# EAGLE schematic stm32f072 (EAGLE 7.7.0)

## Sheet 1 of 3: Keyboard Controller
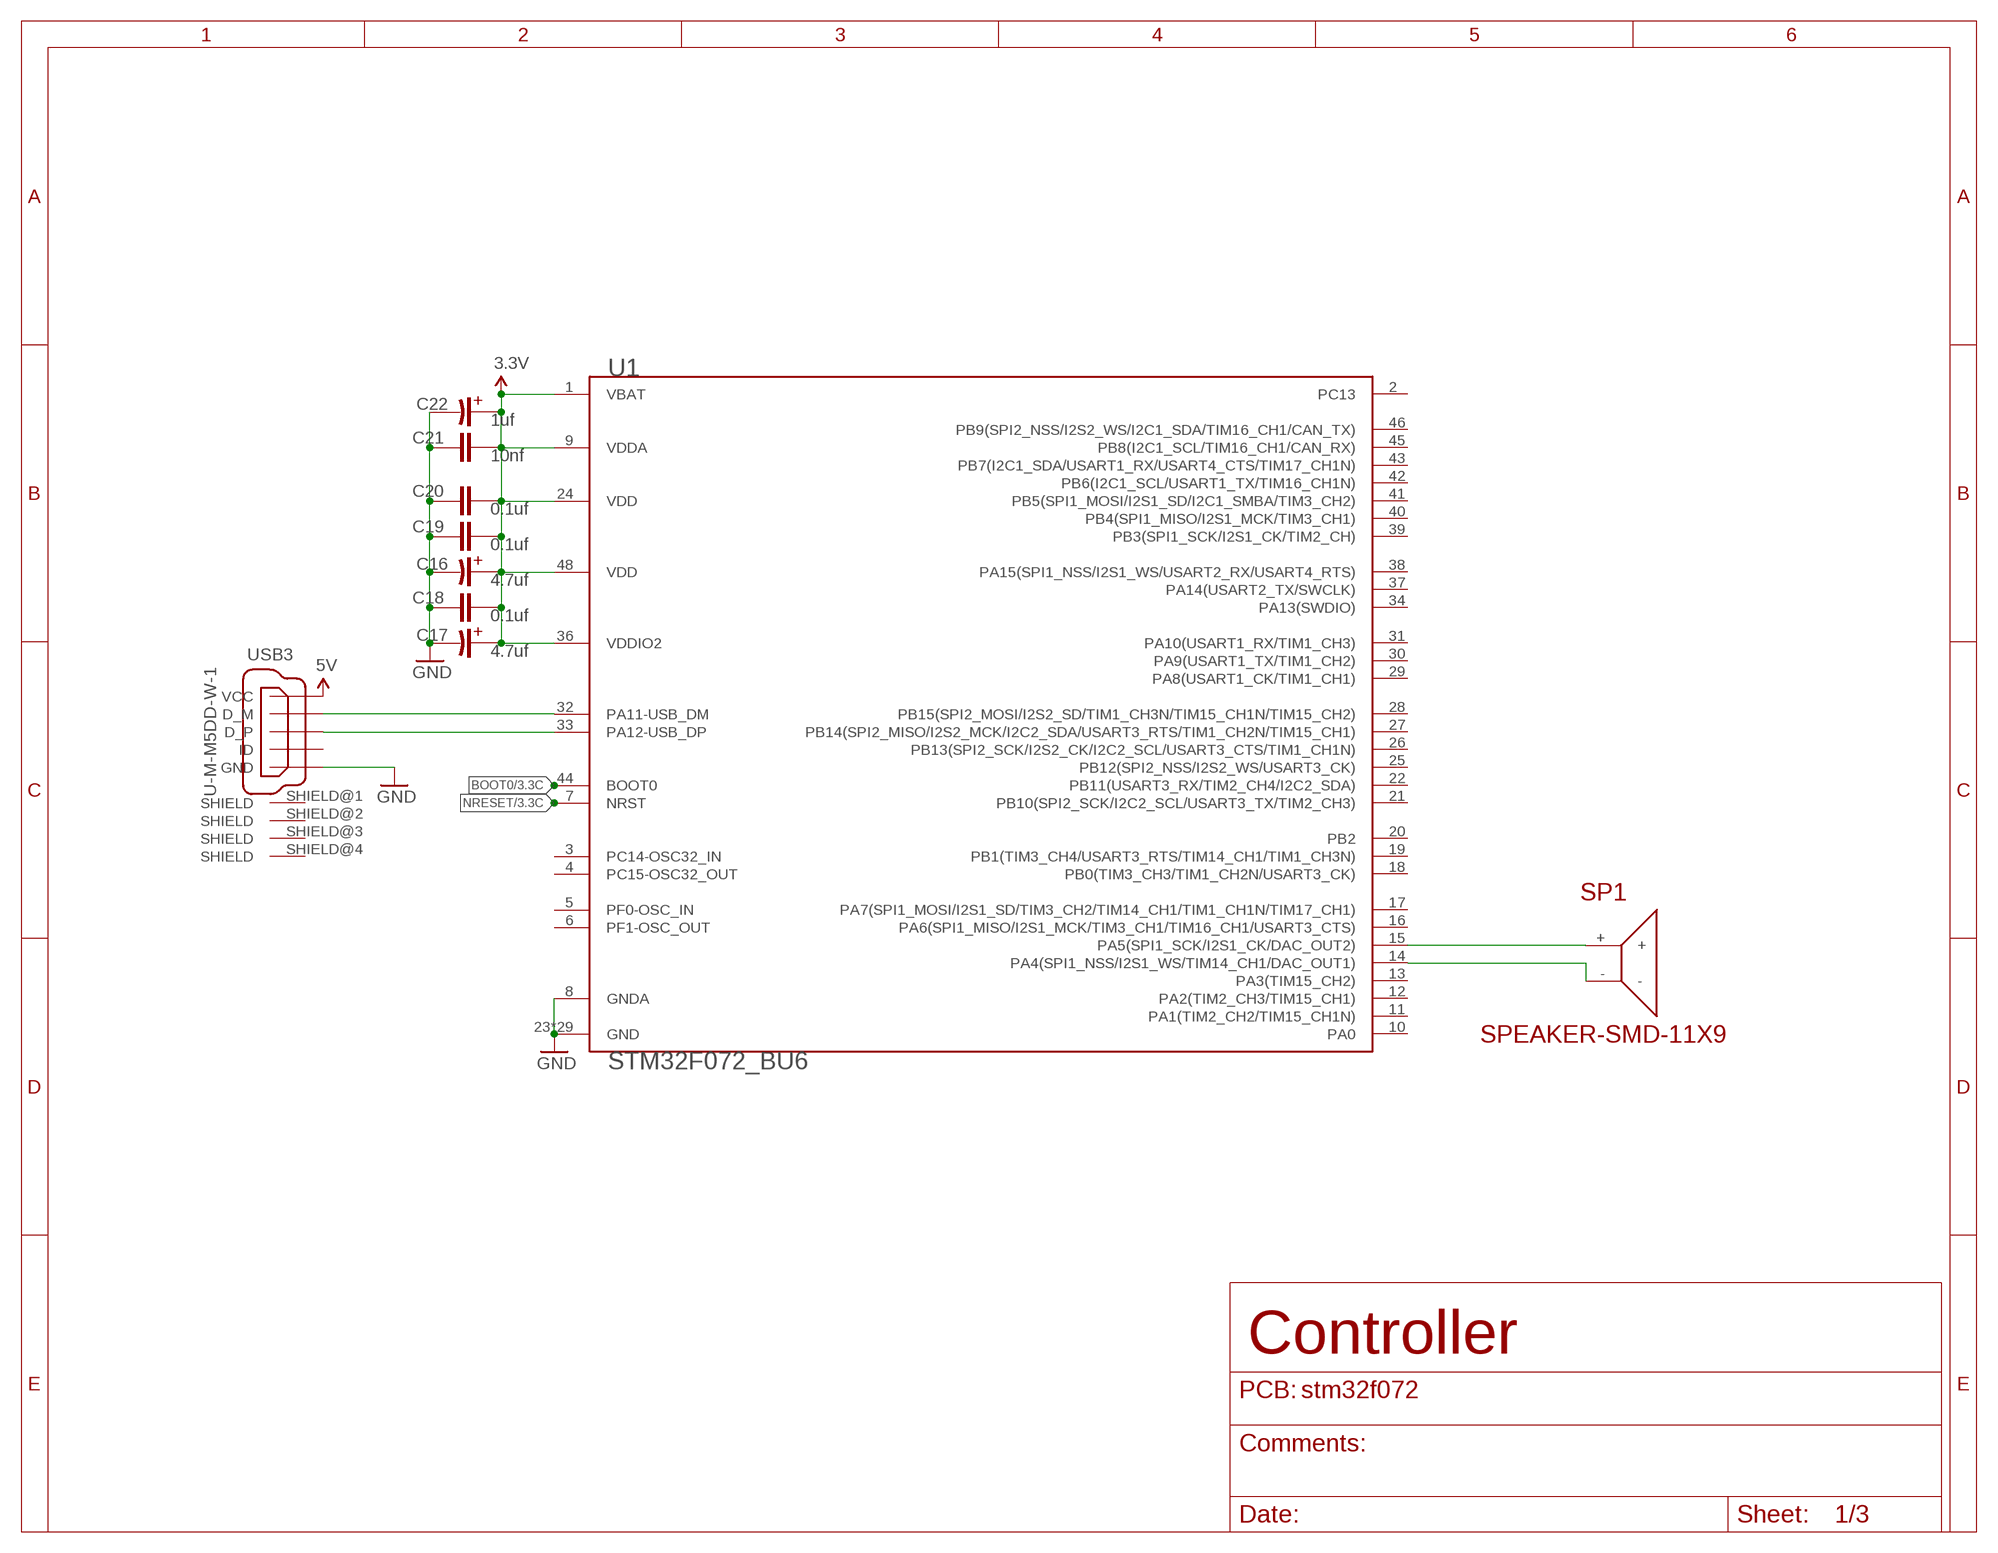
[diagram p0: schematic, sheet 1]

### Parts
C16  4.7uf  CAPACITOR-TANT-0805  [C0805-TANT]
C17  4.7uf  CAPACITOR-TANT-0805  [C0805-TANT]
C18  0.1uf  CAPACITOR-0402  [C0402]
C19  0.1uf  CAPACITOR-0402  [C0402]
C20  0.1uf  CAPACITOR-0402  [C0402]
C21  10nf  CAPACITOR-0402  [C0402]
C22  1uf  CAPACITOR-TANT-0805  [C0805-TANT]
SP1  SPEAKER-SMD-11X9  [AST1109MLTRQ]
U1  STM32F072_BU6  [UFQFPN-48]
USB3  U-M-M5DD-W-1  USB_CONN-LCSC  [U-M-M5DD-W-1]

### Nets
3.3V: C16.1(+) C17.1(+) C18.2 C19.2 C20.2 C21.2 C22.1(+) U1.1(VBAT) U1.9(VDDA) U1.24(VDD) U1.36(VDDIO2) U1.48(VDD) ; also sheet 2,3
5V: USB3.VCC ; also sheet 2
BOOT0: U1.44(BOOT0) ; also sheet 3
GND: C16.2(-) C17.2(-) C18.1 C19.1 C20.1 C21.1 C22.2(-) U1.8(GNDA) U1.23(GND) U1.35(GND) U1.47(GND) U1.P$1(GND) U1.P$2(GND) U1.P$3(GND) U1.P$4(GND) U1.P$5(GND) U1.P$6(GND) U1.P$7(GND) U1.P$8(GND) U1.P$9(GND) U1.P$10(GND) U1.P$11(GND) U1.P$12(GND) U1.P$13(GND) U1.P$14(GND) U1.P$15(GND) U1.P$16(GND) U1.P$17(GND) U1.P$18(GND) U1.P$19(GND) U1.P$20(GND) U1.P$21(GND) U1.P$22(GND) U1.P$23(GND) U1.P$24(GND) U1.P$25(GND) U1.PAD(GND) USB3.GND ; also sheet 2,3
N$1: SP1.+ U1.15(PA5(SPI1_SCK/I2S1_CK/DAC_OUT2))
N$2: SP1.- U1.14(PA4(SPI1_NSS/I2S1_WS/TIM14_CH1/DAC_OUT1))
N$3: U1.32(PA11-USB_DM) USB3.D-(D_M)
N$4: U1.33(PA12-USB_DP) USB3.D+(D_P)
NRESET: U1.7(NRST) ; also sheet 3
Unconnected: U1.2(PC13) U1.3(PC14-OSC32_IN) U1.4(PC15-OSC32_OUT) U1.5(PF0-OSC_IN) U1.6(PF1-OSC_OUT) U1.10(PA0) U1.11(PA1(TIM2_CH2/TIM15_CH1N)) U1.12(PA2(TIM2_CH3/TIM15_CH1)) U1.13(PA3(TIM15_CH2)) U1.16(PA6(SPI1_MISO/I2S1_MCK/TIM3_CH1/TIM16_CH1/USART3_CTS)) U1.17(PA7(SPI1_MOSI/I2S1_SD/TIM3_CH2/TIM14_CH1/TIM1_CH1N/TIM17_CH1)) U1.18(PB0(TIM3_CH3/TIM1_CH2N/USART3_CK)) U1.19(PB1(TIM3_CH4/USART3_RTS/TIM14_CH1/TIM1_CH3N)) U1.20(PB2) U1.21(PB10(SPI2_SCK/I2C2_SCL/USART3_TX/TIM2_CH3)) U1.22(PB11(USART3_RX/TIM2_CH4/I2C2_SDA)) U1.25(PB12(SPI2_NSS/I2S2_WS/USART3_CK)) U1.26(PB13(SPI2_SCK/I2S2_CK/I2C2_SCL/USART3_CTS/TIM1_CH1N)) U1.27(PB14(SPI2_MISO/I2S2_MCK/I2C2_SDA/USART3_RTS/TIM1_CH2N/TIM15_CH1)) U1.28(PB15(SPI2_MOSI/I2S2_SD/TIM1_CH3N/TIM15_CH1N/TIM15_CH2)) U1.29(PA8(USART1_CK/TIM1_CH1)) U1.30(PA9(USART1_TX/TIM1_CH2)) U1.31(PA10(USART1_RX/TIM1_CH3)) U1.34(PA13(SWDIO)) U1.37(PA14(USART2_TX/SWCLK)) U1.38(PA15(SPI1_NSS/I2S1_WS/USART2_RX/USART4_RTS)) U1.39(PB3(SPI1_SCK/I2S1_CK/TIM2_CH)) U1.40(PB4(SPI1_MISO/I2S1_MCK/TIM3_CH1)) U1.41(PB5(SPI1_MOSI/I2S1_SD/I2C1_SMBA/TIM3_CH2)) U1.42(PB6(I2C1_SCL/USART1_TX/TIM16_CH1N)) U1.43(PB7(I2C1_SDA/USART1_RX/USART4_CTS/TIM17_CH1N)) U1.45(PB8(I2C1_SCL/TIM16_CH1/CAN_RX)) U1.46(PB9(SPI2_NSS/I2S2_WS/I2C1_SDA/TIM16_CH1/CAN_TX)) USB3.ID USB3.SHIELD@1(SHIELD) USB3.SHIELD@2(SHIELD) USB3.SHIELD@3(SHIELD) USB3.SHIELD@4(SHIELD)

### Notes on the sheet
- Controller

## Sheet 2 of 3: Power
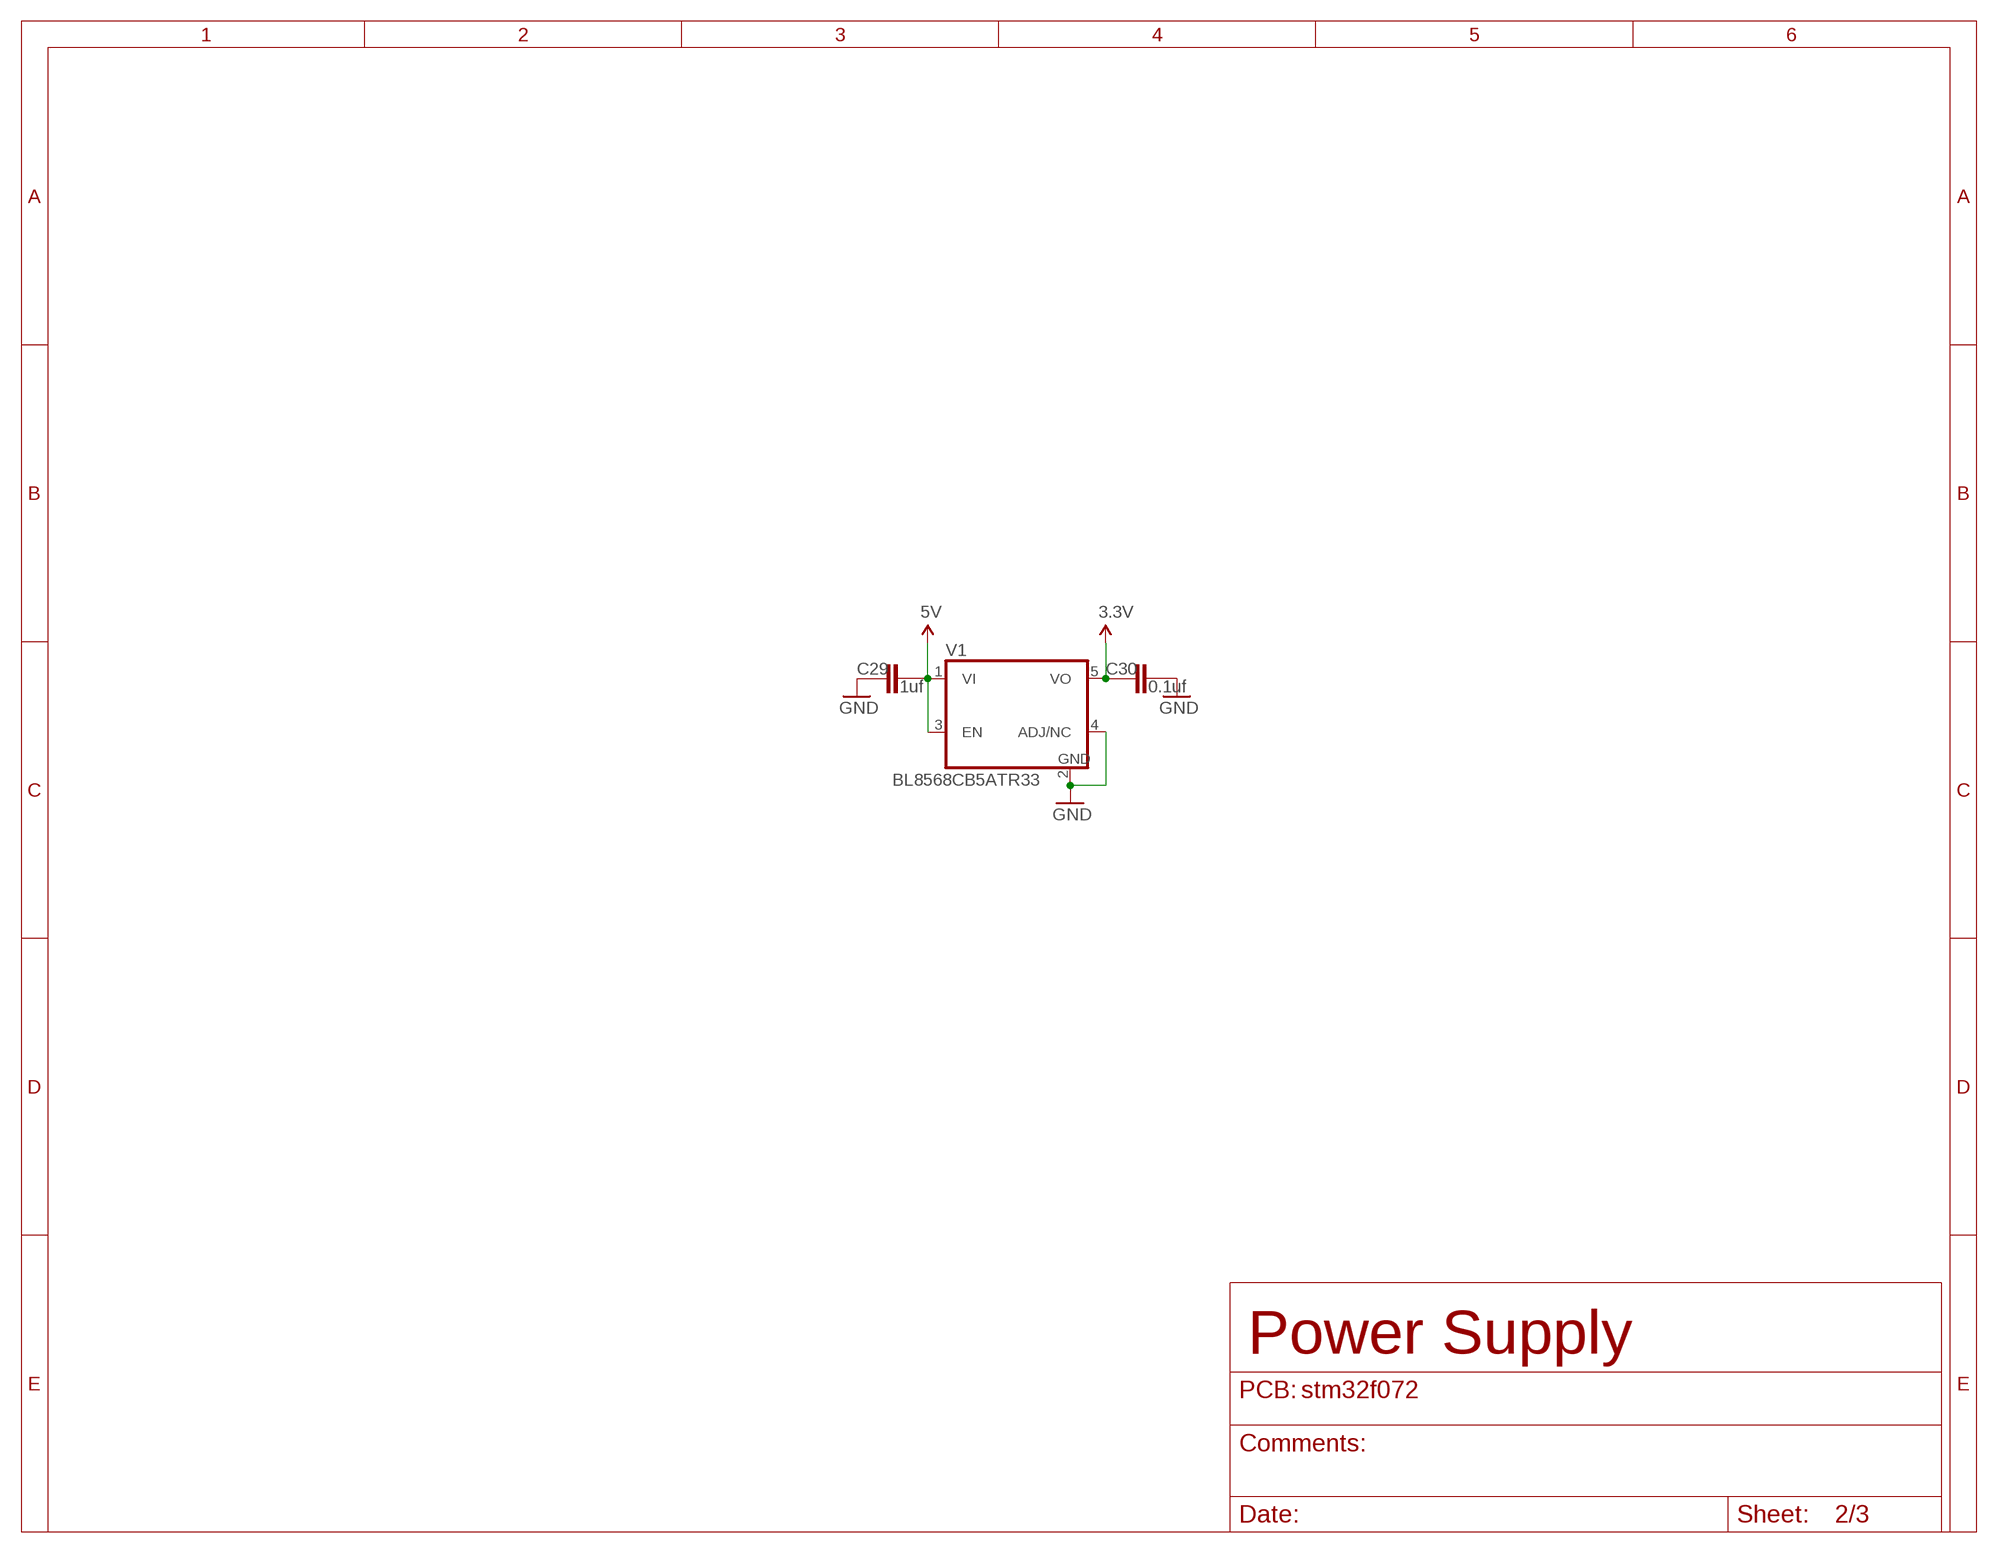
[diagram p1: schematic, sheet 2]

### Parts
C29  1uf  CAPACITOR-0402  [C0402]
C30  0.1uf  CAPACITOR-0402  [C0402]
V1  BL8568CB5ATR33  LDO-VR  [SOT-23-5]

### Nets
3.3V: C30.1 V1.5(VO) ; also sheet 1,3
5V: C29.2 V1.1(VI) V1.3(EN) ; also sheet 1
GND: C29.1 C30.2 V1.2(GND) V1.4(ADJ/NC) ; also sheet 1,3

### Notes on the sheet
- Power Supply

## Sheet 3 of 3: RESET
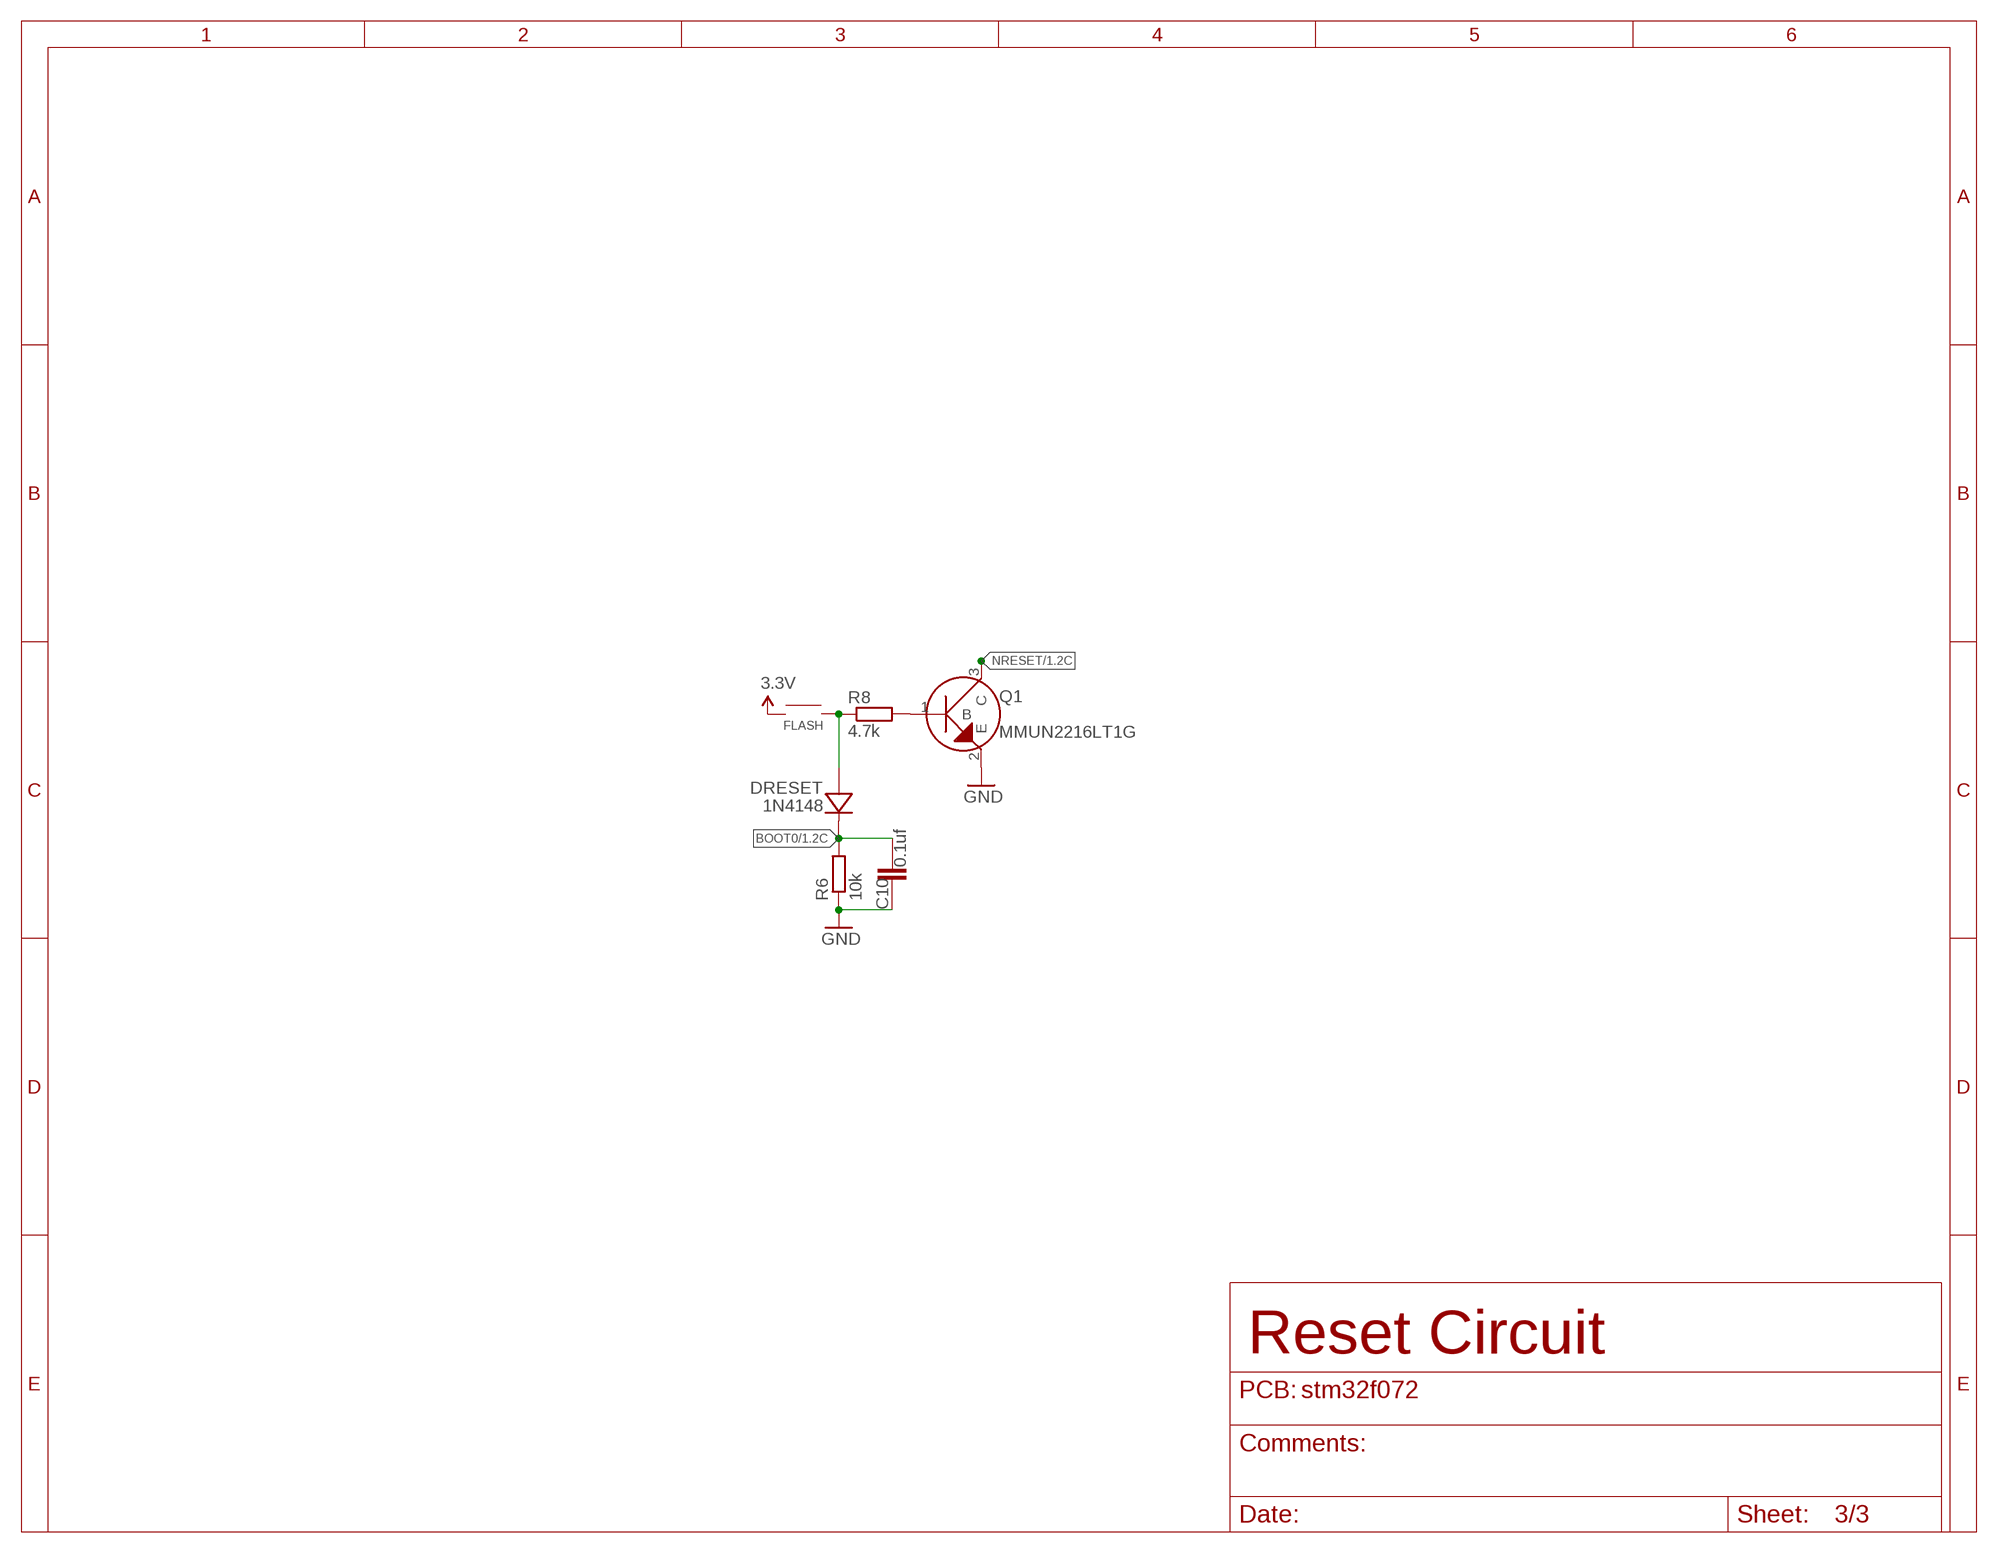
[diagram p2: schematic, sheet 3]

### Parts
C10  0.1uf  CAPACITOR-0402  [C0402]
DRESET  1N4148  DIODE-SOD-123  [SOD-123]
FLASH  SKRPABE010  SWITCH-SMD-SKRPABE010  [SWITCH-SMD-SKRPABE010]
Q1  MMUN2216LT1G  TRANSISTOR-NPN  [SOT-23-3]
R6  10k  RESISTOR-0405  [R0402]
R8  4.7k  RESISTOR-0405  [R0402]

### Nets
3.3V: FLASH.1A FLASH.1B ; also sheet 1,2
BOOT0: C10.2 DRESET.C R6.2 ; also sheet 1
FLASH: DRESET.A FLASH.2A FLASH.2B R8.1
GND: C10.1 Q1.2(E) R6.1 ; also sheet 1,2
N$80: Q1.1(B) R8.2
NRESET: Q1.3(C) ; also sheet 1

### Notes on the sheet
- Reset Circuit

## Library data of the parts
C10 C18-C21 C29 C30 = Components:CAPACITOR
C16 C17 C22 = Components:CAPACITOR-TANT
DRESET = Components:DIODE: Standard 1N4148 diode
FLASH = Hardware:SWITCH-SMD
Q1 = Components:TRANSISTOR-NPN
R6 R8 = Components:RESISTOR
SP1 = Components:SPEAKER
U1 = Controller:STM32F072_BU6
USB3 = USB:USB_CONN
V1 = Controller:LDO-VR: LDO Voltage Regulator

## Net classes
0 default: width 0.15 mm, drill 0.25 mm, clearance 0.15 mm
1 PLUG_USB: width 0.25 mm, drill 0.25 mm, clearance 0.15 mm
3 VCC: width 0.25 mm, drill 0.25 mm, clearance 0.15 mm